# Altium schematic sheet main.SchDoc
size 209 x 297 mm; Address1: Address1; Address2: Address2; Address3: Address3; Address4: Address4; DocumentNumber: 1; SheetNumber: 1; SheetTotal: 7; Scale: 1:1; Обозначение документа: АБВГ.123456.001 Э3; Разраб.: Иванов; Пров.: Петров; Утв.: Сидоров; Наименование организации: ОАО "Ваша фирма"; Перв. применение: АБВГ.123456.000; Наименование изделия 1: Плата; Наименование изделия 2: Схема электрическая; Наименование изделия 3: принципиальная; Нач. отд.: Нач. отд.; Фамилия нач. отд.: Сидоров
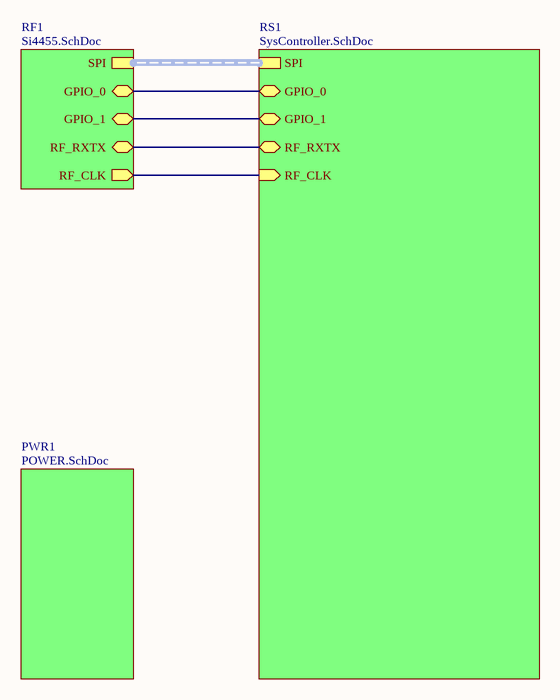
[diagram p0: main.SchDoc]

## Sub-sheets
PWR1 = POWER.SchDoc: no entries
RF1 = Si4455.SchDoc: SPI (harness SPI), RF_RXTX (bidir), RF_CLK (out), GPIO_0 (bidir), GPIO_1 (bidir)
RS1 = SysController.SchDoc: RF_CLK (in), RF_RXTX (bidir), SPI (harness SPI), GPIO_0 (bidir), GPIO_1 (bidir)

## Nets
(unnamed): sheet RS1/RF_CLK, sheet RF1/RF_CLK
(unnamed): sheet RS1/RF_RXTX, sheet RF1/RF_RXTX
(unnamed): sheet RS1/GPIO_0, sheet RF1/GPIO_0
(unnamed): sheet RS1/GPIO_1, sheet RF1/GPIO_1

## Buses and harness runs
harness sheet RF1/SPI = sheet RS1/SPI

## Notes on the sheet
- Перв. примен.
- Справ. №
- Подп. и дата
- Инв. № дубл.
- Взам. инв. №
- Разраб.
- Изм.
- Лист
- № докум.
- Подп.
- Дата
- Лит.
- Масса
- Масштаб
- Пров.
- Т.контр.
- Листов
- Инв. № подл.
- Утв.
- Н.контр.
- Копировал
- Формат А4